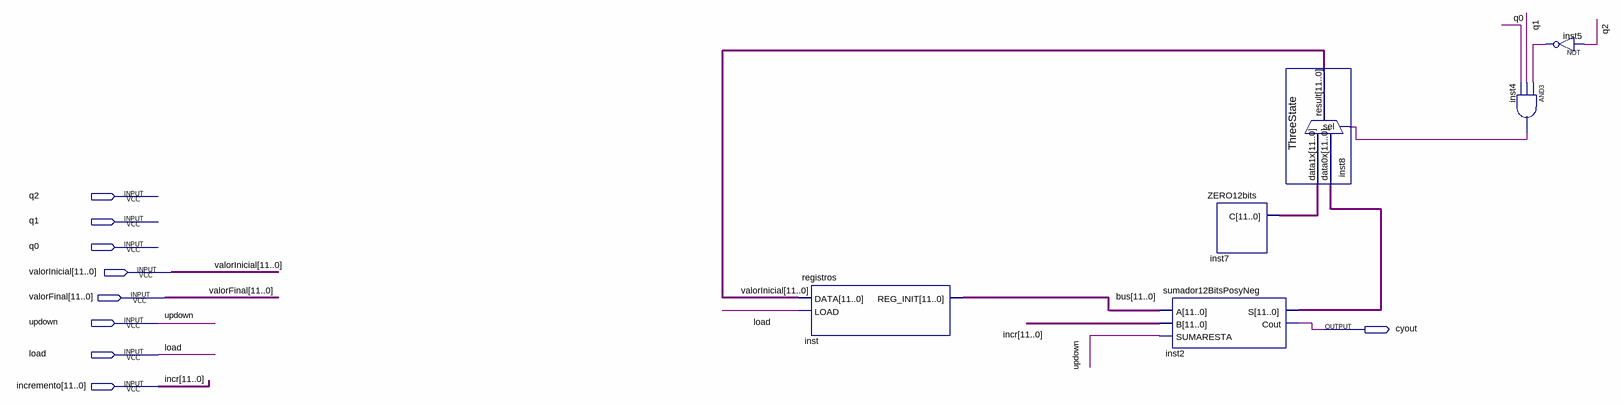
[diagram p0: schematic sheet]
// Quartus schematic pruebaSumadorRetroalimentacion.bdf as structural Verilog: 6 symbols, 9 pins
module pruebaSumadorRetroalimentacion (
  input  q2,
  input  q1,
  input  q0,
  input  [11:0] valorInicial,
  input  [11:0] valorFinal,
  input  updown,
  input  load,
  input  [11:0] incremento,
  output cyout
);

  wire inst4_out, inst5_out;
  wire [11:0] bus, inst2_s, inst7_c;

  registros inst (.DATA(valorInicial), .LOAD(load), .REG_INIT(bus));
  sumador12BitsPosyNeg inst2 (.A(bus), .B(incremento), .SUMARESTA(updown), .S(inst2_s), .Cout(cyout));
  ZERO12bits inst7 (.C(inst7_c));
  ThreeState inst8 (.data1x(inst7_c), .data0x(inst2_s), .sel(inst4_out), .result(valorInicial));
  and inst4 (inst4_out, inst5_out, q1, q0);
  not inst5 (inst5_out, q2);

  // Other names for the same wires on the sheet: incr[11:0] = incremento
endmodule
